# EAGLE design programmer_reva (EAGLE 9.1.3)
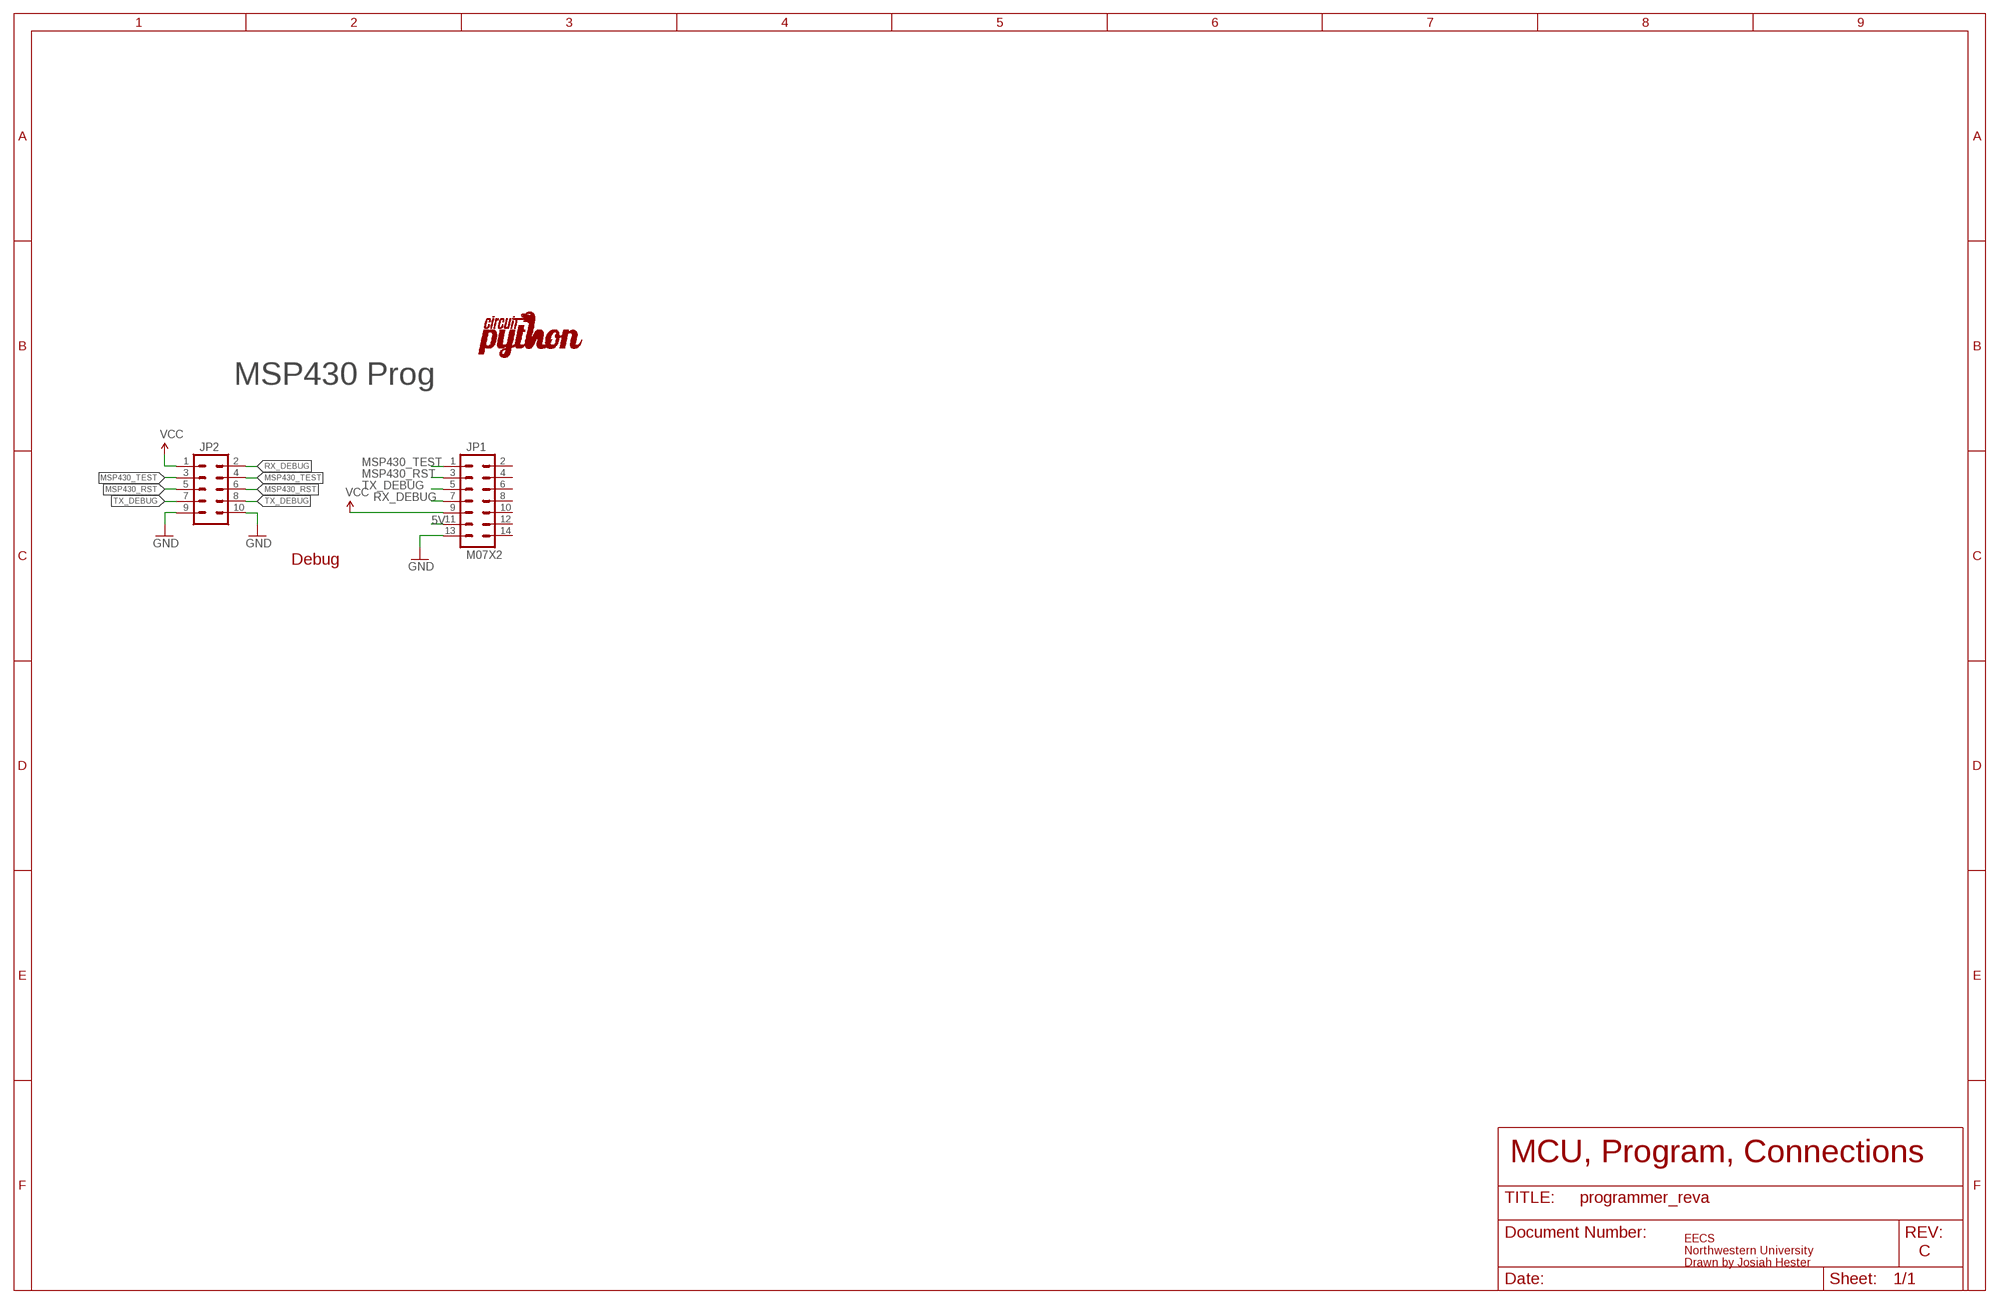
[diagram p0: schematic, sheet 1]

## Parts
JP1  M07X2  [2X7]
JP2  M05X21.27MM  [2X5_1.27MM]
U$2  LOGO  [CIRCUITPYTHON-LOGO]

## Nets
5V: JP1.11
GND: JP1.13 JP2.9 JP2.10
MSP430_RST: JP1.3 JP2.5 JP2.6
MSP430_TEST: JP1.1 JP2.3 JP2.4
RX_DEBUG: JP1.7 JP2.2
TX_DEBUG: JP1.5 JP2.7 JP2.8
VCC: JP1.9 JP2.1
Unconnected: JP1.2 JP1.4 JP1.6 JP1.8 JP1.10 JP1.12 JP1.14

## Notes on the sheet
- MSP430 Prog
- Debug
- MCU, Program, Connections
- C
- EECS
  Northwestern University
  Drawn by Josiah Hester

## Library data of the parts
JP1 = SparkFun-Connectors:M07X2
JP2 = SparkFun-Connectors:M05X2: Header 5x2 Standard 10-pin dual row 0.1" header. Commonly used with AVR-ISP. Use with Spark Fun Electronics SKU: PRT-00778; DIGIKEY: 1175-1627-ND
U$2 = circuitpython-logo:LOGO

## Net classes
0 default: width 0.33 mm, drill 0.33 mm, clearance 0.152 mm

## Board
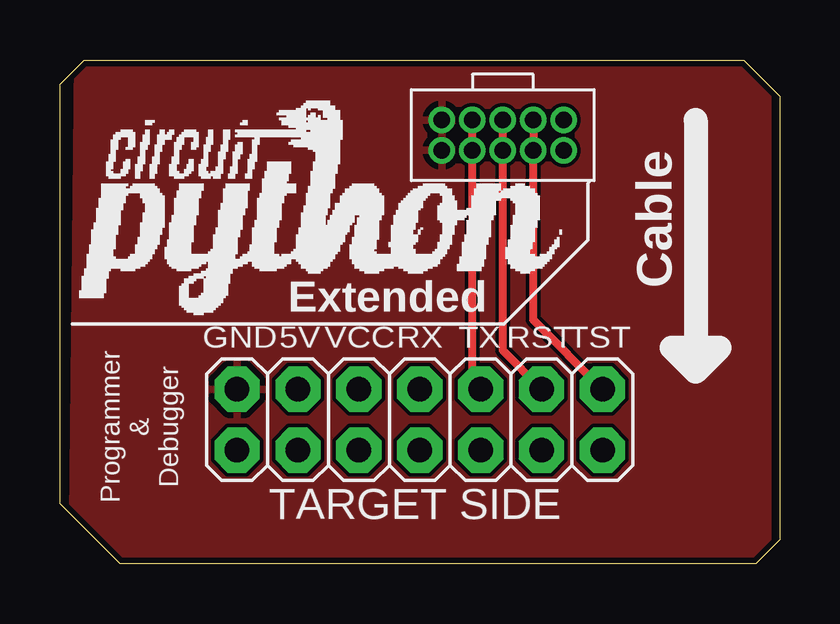
[diagram p1: board, top side]
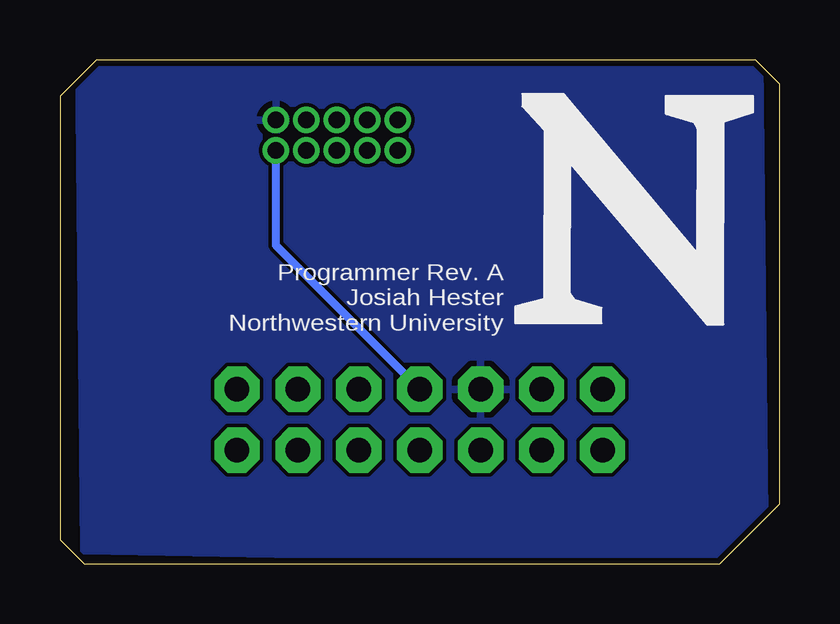
[diagram p2: board, bottom side, seen from below]

Size 30 x 21 mm. Coordinates in mm from the lower left corner, seen from the top.
Outline: 0,20 1,21 28.5,21 30,19.5 30,1 29,0 2.5,0 0,2.5 0,20
Copper layers (1*16): Top 0.0356mm / dielectric 1.5011mm / Bottom 0.0356mm
Design rules "PCBUnlimited": minimum track width 5mil, minimum drill 8mil, track to track 5mil, track to pad 5mil, pad to pad 5mil, via to via 5mil, smd to smd 5mil, copper to edge 10mil, drill to drill 5mil, minimum pad ring 7mil, minimum via ring 7mil, stop-mask expansion 3mil, vias tented up to drill 0mil, thermal gap 10mil

### Footprints (pad centres in the part's own frame; a part is rotated, then mirrored left to right if it is on the bottom)
2X7 = drill 1.016 pad 1.88 octagon: 1 -7.62,-1.27; 2 -7.62,1.27; 3 -5.08,-1.27; 4 -5.08,1.27; 5 -2.54,-1.27; 6 -2.54,1.27; 7 0,-1.27; 8 0,1.27; 9 2.54,-1.27; 10 2.54,1.27; 11 5.08,-1.27; 12 5.08,1.27; 13 7.62,-1.27; 14 7.62,1.27
2X5_1.27MM = drill 0.7 pad 1.1: 1 0,0; 2 1.27,0; 3 0,-1.27; 4 1.27,-1.27; 5 0,-2.54; 6 1.27,-2.54; 7 0,-3.81; 8 1.27,-3.81; 9 0,-5.08; 10 1.27,-5.08

### Placement (x,y rotation side)
JP1  15,6 180 top
JP2  21,18.5 270 top
U$1  [NU-LOGO]  11,10 0 bottom
U$2  0.65,9.6 0 top

### Tracks (layer width: path | path; a pad name or v marks a point on that pad's centre or on a via)
GND
  pour Top: 0.5,0 29.5,0 29.5,21 0.73,21
MSP430_RST
  Top 0.33: JP1.3 18.46,8.89 JP2.6 JP2.5
MSP430_TEST
  Top 0.33: JP1.1 19.73,10.16 JP2.4 JP2.3
RX_DEBUG
  Bottom 0.33: JP1.7 21,13.27 JP2.2
TX_DEBUG
  Top 0.33: JP1.5 17.19,7.62 JP2.8 JP2.7
VCC
  pour Bottom: 0.6,0 29,0.54 29.23,21 0.83,21

### Text on the board
tPlace: Cable | Extended | GND | 5V | VCC | RX | TX | RST | TST | Programmer / & / Debugger | TARGET SIDE
bPlace: Programmer Rev. A / Josiah Hester / Northwestern University